# EAGLE design InputBlock (EAGLE 9.6.2)
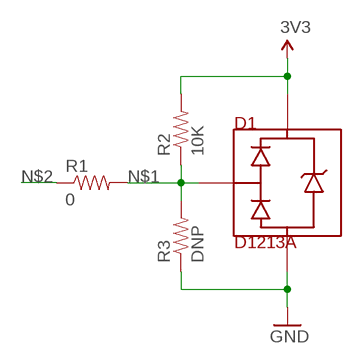
[diagram p0: schematic, sheet 1]

## Parts
D1  D1213A  D1213A-DLP  [DLP]
R1  0  RES-0-0603  [0603-RES]
R2  10K  RES-10K-06030603  [0603-RES]
R3  DNP  RES-DNP-0603  [0603-RES]

## Nets
3V3: D1.VCC R2.2
GND: D1.GND R3.1
N$1: D1.SIGNAL R1.2 R2.1 R3.2
N$2: R1.1

## Library data of the parts
D1 = rickk2:D1213A-DLP: Dataline protecvtion 3.3V - Zener + Rail-to-rail Diodes Incorporated D1213A-02SOL-7 $0.40 TVS DIODE 3.3V 10V SOT23 10V (Typ) Clamp 1A (8/20µs) Ipp Tvs Diode Surface Mount SOT-23 https://www.digikey.com/product-detail/en/diodes-incorporated/D1213A-02SOL-7/D1213A-02SOL-7DICT-ND/3340437 Ordered 10 2019-04-10 Left = Signal, Top = VCC, Bottom=GND
R1 = rickk2:RES-0-0603: RES SMD 0 OHM JUMPER 1/10W 0603 Panasonic Electronic Components ERJ-3GEY0R00V 0 Ohms Jumper 0.1W, 1/10W Chip Resistor 0603 (1608 Metric) Automotive AEC-Q200 Thick Film https://www.digikey.com/product-detail/en/panasonic-electronic-components/ERJ-3GEY0R00V/P0-0GCT-ND/134711
R2 = rickk2:RES-10K-0603: RES SMD 10K OHM 5% 1/4W 0603 $ 0.10 https://www.digikey.com/product-detail/en/panasonic-electronic-components/ERJ-PA3J103V/P10KBZCT-ND/5036237
R3 = rickk2:RES-DNP-0603: Do Not Populate

## Board
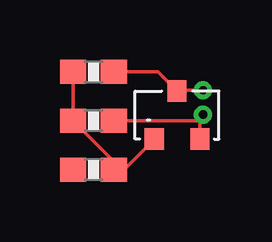
[diagram p1: board, top side]

No outline drawn. Coordinates in mm, seen from the top.
Copper layers (1*16): Top 0.035mm / dielectric 1.5mm / Bottom 0.035mm
Design rules "default": minimum track width 6mil, minimum drill 0.35mm, track to track 6mil, track to pad 6mil, pad to pad 6mil, via to via 6mil, smd to smd 6mil, copper to edge 40mil, drill to drill 6mil, minimum pad ring 10mil, minimum via ring 8mil, stop-mask expansion 4mil, vias tented up to drill 0mil, thermal gap 10mil

### Footprints (pad centres in the part's own frame; a part is rotated, then mirrored left to right if it is on the bottom)
DLP = smd 0.8 x 0.9: GND 0.95,2; SIGNAL 0,0; VCC 1.9,0
0603-RES = smd 1.1 x 1: 1 -0.85,0; 2 0.85,0

### Placement (x,y rotation side)
D1  5.08,3.81 0 top
R1  2.54,2.54 0 top
R2  2.54,4.57 0 top
R3  2.54,6.6 180 top

### Tracks (layer width: path | path; a pad name or v marks a point on that pad's centre or on a via)
3V3  (via drill 0.35)
  Top 0.152: D1.VCC 6.98,4.69 | 6.98,4.69 v7.11,4.83 | 6.98,4.69 6.86,4.57 R2.2
GND  (via drill 0.35)
  Top 0.152: v7.11,5.84 6.06,5.84 D1.GND 5.24,6.6 R3.1
N$1
  Top 0.152: R3.2 R2.1 3.39,2.87 R1.2 3.81,2.54 D1.SIGNAL